# Altium schematic sheet CircuitoMedidorADE.SchDoc: ADE7953
size A4; Address1: Medidor de energia PROSER; Address2: MEI-300V; DocumentNumber: 3; Revision: 01; SheetNumber: 3; SheetTotal: 6
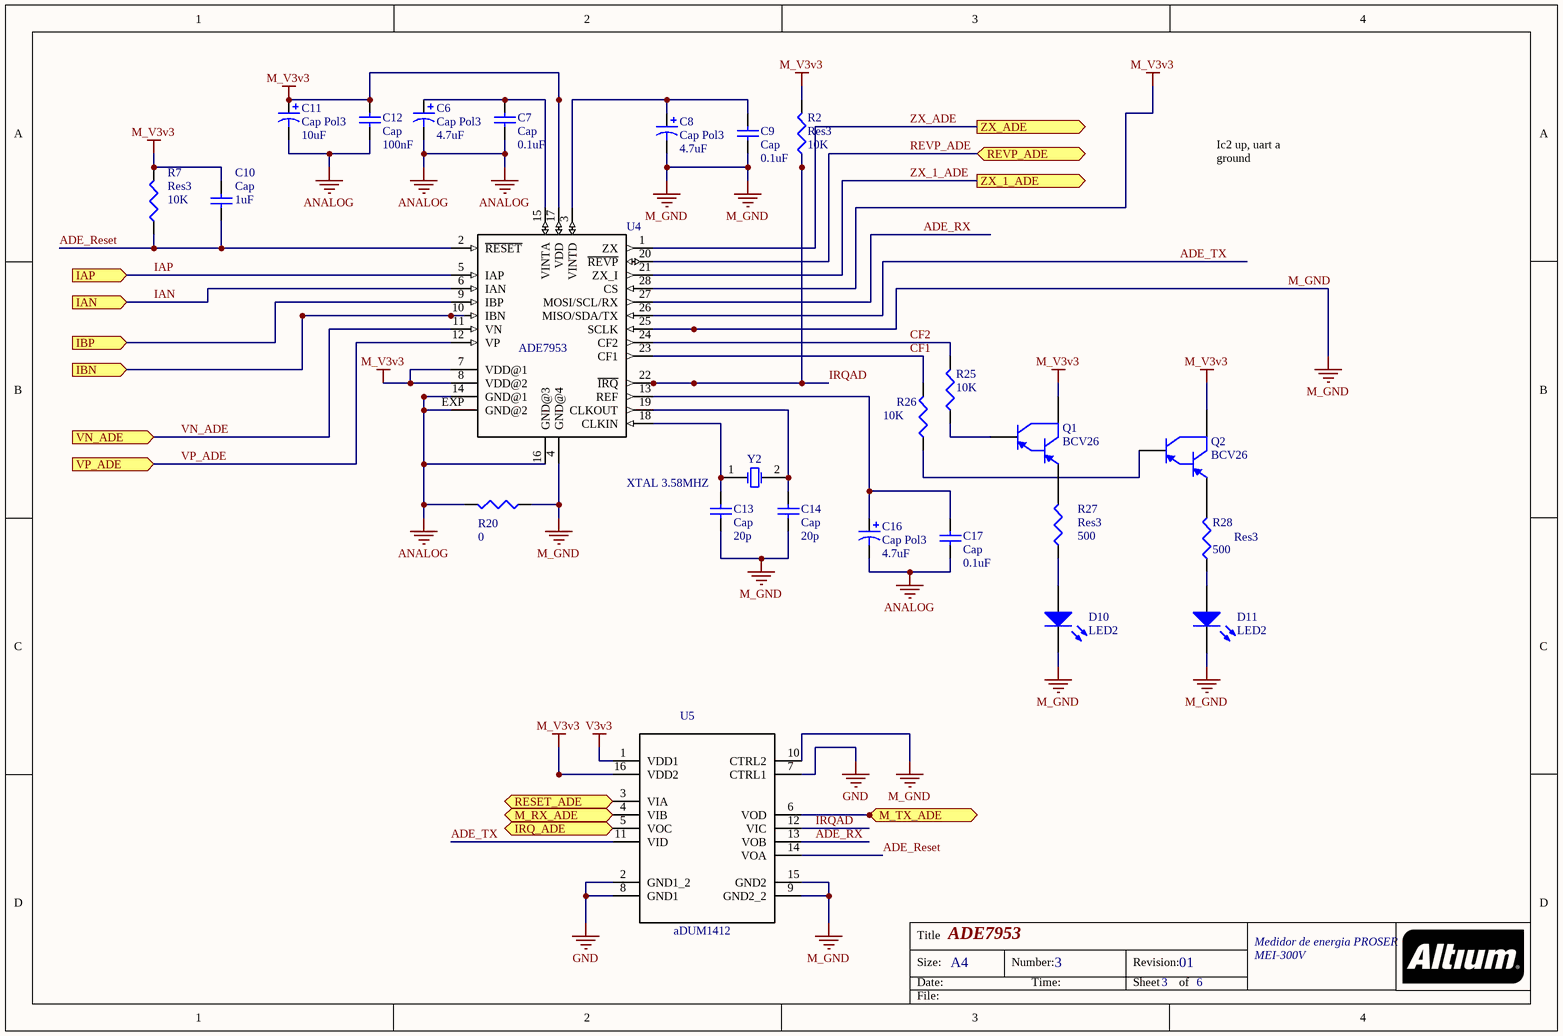
[diagram p0: CircuitoMedidorADE.SchDoc]

## Parts
C6  Cap Pol3  value 4.7uF  [Custom0805]
C7  Cap  value 0.1uF  [Custom0805]
C8  Cap Pol3  value 4.7uF  [Custom0805]
C9  Cap  value 0.1uF  [Custom0805]
C10  Cap  value 1uF  [Custom0805]
C11  Cap Pol3  value 10uF  [Custom0805]
C12  Cap  value 100nF  [Custom0805]
C13  Cap  value 20p  [Custom0805]
C14  Cap  value 20p  [Custom0805]
C16  Cap Pol3  value 4.7uF  [Custom0805]
C17  Cap  value 0.1uF  [Custom0805]
D10  LED2  [Custom0805]
D11  LED2  [Custom0805]
Q1  BCV26  [SOT23_L]
Q2  BCV26  [SOT23_L]
R2  Res3  value 10K  [Custom0805]
R7  Res3  value 10K  [Custom0805]
R20  value 0  [Custom0805]  (hidden comment: Res3)
R25  value 10K  [Custom0805]  (hidden comment: Rb)
R26  value 10K  [Custom0805]  (hidden comment: Rb)
R27  Res3  value 500  [Custom0805]
R28  Res3  value 500  [Custom0805]
U4  ADE7953  [*LFCSP28_ADE7953(Primary)]
U5  aDUM1412  [*SOIC127P1032X265-16N]
Y2  XTAL 3.58MHZ  [XTAL1140X475X430D1315L440X63M]

## Ports
IAN (in), IAP (in), IBN (in), IBP (in), IRQ_ADE (out), M_RX_ADE (in), M_TX_ADE (out), RESET_ADE (in), REVP_ADE (bidir), VN_ADE (in), VP_ADE (in), ZX_1_ADE (out), ZX_ADE (out)

## Nets
ANALOG: C6.2 C7.1 C11.2 C12.1 C16.2 C17.1 R20.2 U4.14(GND@1) U4.16(GND@3) U4.EXP(GND@2)
GND: U5.2(GND1_2) U5.7(CTRL1) U5.8(GND1)
M_GND: C8.2 C9.1 C13.1 C14.1 D10.2(K) D11.2(K) R20.1 U4.4(GND@4) U4.25(SCLK) U5.9(GND2_2) U5.10(CTRL2) U5.15(GND2)
M_V3v3: C10.2 C11.1 C12.2 Q1.3(C) Q2.3(C) R2.2 R7.2 U4.7(VDD@1) U4.8(VDD@2) U4.17(VDD) U4.28(CS) U5.16(VDD2)
V3v3: U5.1(VDD1)
ADE_Reset: C10.1 R7.1 U4.2(~{RESET}) U5.14(VOA)
ADE_RX: U4.27(MOSI/SCL/RX) U5.13(VOB)
ADE_TX: U4.26(MISO/SDA/TX) U5.11(VID)
CF1: R26.2 U4.23(CF1)
CF2: R25.2 U4.24(CF2)
IAN: U4.6(IAN) ; port IAN
IAP: U4.5(IAP) ; port IAP
IBN: U4.10(IBN) ; port IBN
IBP: U4.9(IBP) ; port IBP
IRQ_ADE: U5.5(VOC) ; port IRQ_ADE
IRQAD: R2.1 U4.22(~{IRQ}) U5.12(VIC)
M_RX_ADE: U5.4(VIB) ; port M_RX_ADE
M_TX_ADE: U5.6(VOD) ; port M_TX_ADE
RESET_ADE: U5.3(VIA) ; port RESET_ADE
REVP_ADE: U4.20(~{REVP}) ; port REVP_ADE
VN_ADE: U4.11(VN) ; port VN_ADE
VP_ADE: U4.12(VP) ; port VP_ADE
ZX_1_ADE: U4.21(ZX_I) ; port ZX_1_ADE
ZX_ADE: U4.1(ZX) ; port ZX_ADE
NetC6_1: C6.1 C7.2 U4.15(VINTA)
NetC8_1: C8.1 C9.2 U4.3(VINTD)
NetC13_2: C13.2 U4.18(CLKIN) Y2.1(OSC1)
NetC14_2: C14.2 U4.19(CLKOUT) Y2.2(OSC2)
NetC16_1: C16.1 C17.2 U4.13(REF)
NetD10_1: D10.1(A) R27.1
NetD11_1: D11.1(A) R28.1
NetQ1_1: Q1.1(E) R27.2
NetQ1_2: Q1.2(B) R25.1
NetQ2_1: Q2.1(E) R28.2
NetQ2_2: Q2.2(B) R26.1

## Notes on the sheet
- Ic2 up, uart a ground
- Title
- Size:
- Date:
- A4
- Number:
- Time:
- Revision:
- Sheet
- of
- File:

## Library data of the parts
C6 C8 C11 C16 = Cap Pol3: Polarized Capacitor (Surface Mount); Published: 8-Jun-2000; LatestRevisionDate: 29-May-2009; LatestRevisionNote: IPC-7351 Footprint Added.; PackageReference: C0805; Publisher: Altium Limited; PackageDescription: Chip Capacitor
C7 C9 C10 C12-C14 C17 = Cap: Capacitor; Published: 8-Jun-2000; LatestRevisionDate: 17-Jul-2002; LatestRevisionNote: Re-released for DXP Platform.; PackageReference: RAD-0.3; Publisher: Altium Limited; PackageDescription: Radial Cap, Thru-Hole; 2 Leads; 0.3 in Pin Spacing
D10 D11 = LED2: Typical RED, GREEN, YELLOW, AMBER GaAs LED; Published: 8-Jun-2000; LatestRevisionDate: 17-Jul-2002; LatestRevisionNote: Re-released for DXP Platform.; PackageVersion: Feb-2002; PackageReference: 3.2X1.6X1.1; Publisher: Altium Limited; PackageDescription: SM LED; 2 Flat Leads
Q1 Q2 = PNP1: PNP Darlington Bipolar Transistor; Published: 8-Jun-2000; LatestRevisionDate: 17-Jul-2002; LatestRevisionNote: Re-released for DXP Platform.; DatasheetVersion: May-1994; PackageVersion: 1995/1996; PackageReference: E3; Publisher: Altium Limited; PackageDescription: TO, Flat Index; 3 In-Line, Axial Leads; Body Dia. 4.6mm; Lead Dia. 0.5 mm (max); ComponentLink1Description: Manufacturer Link; ComponentLink1URL: http://www.zetex.com/
R2 R7 R20 R25-R28 = Res3: Resistor; Published: 8-Jun-2000; LatestRevisionDate: 29-May-2009; LatestRevisionNote: IPC-7351 Footprint Added.; PackageReference: J1-0603; Publisher: Altium Limited; PackageDescription: Chip Resistor
U4 = ADE7953: MF: Analog Devices; Availability: Unavailable; Price: None; MP: ADE7953; Package: None; SnapEDA_Link: https://www.snapeda.com/parts/ADE7953/Analog%20Devices/view-part/?ref=snap; Value: *
U5 = ADUM1411ARWZ-RL: Digital Isolator CMOS 4-CH 1Mbps 16-Pin SOIC W T/R; MF: Analog Devices; Package: SOIC-16 Analog Devices; Availability: Unavailable; MP: ADUM1411ARWZ-RL; SnapEDA_Link: https://www.snapeda.com/parts/ADUM1411ARWZ-RL/Analog%20Devices%20Inc./view-part/?ref=snap; Price: None; Value: *
Y2 = XTAL: Crystal Oscillator; Published: 8-Jun-2000; LatestRevisionDate: 17-Jul-2002; LatestRevisionNote: Re-released for DXP Platform.; PackageReference: R38; Publisher: Altium Limited; PackageDescription: Crystal, Thru-Hole; 2 Leads; Body 3.1 x 8.2 mm (Dia.xH)